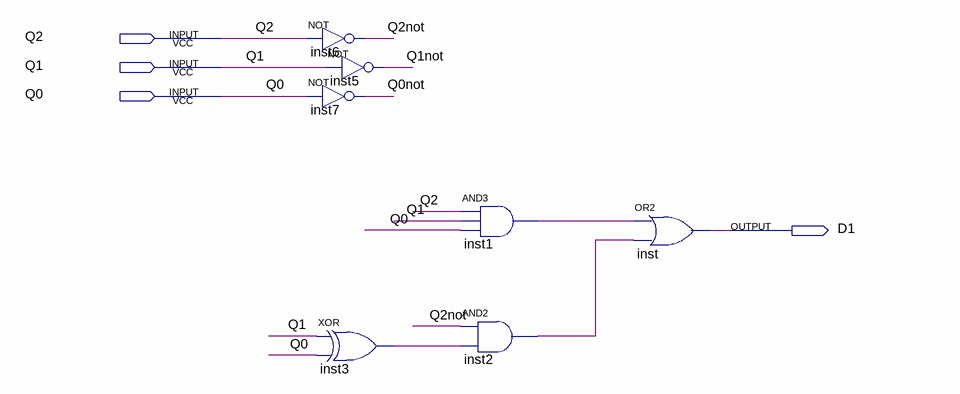
[diagram p0: schematic sheet]
// Quartus schematic D1.bdf as structural Verilog: 7 symbols, 4 pins
module D1 (
  input  Q2,
  input  Q1,
  input  Q0,
  output D1
);

  wire inst1_out, inst2_out, inst3_out, Q0not, Q1not, Q2not;

  not inst6 (Q2not, Q2);
  not inst7 (Q0not, Q0);
  not inst5 (Q1not, Q1);
  xor inst3 (inst3_out, Q1, Q0);
  and inst1 (inst1_out, Q2, Q1, Q0);
  and inst2 (inst2_out, Q2not, inst3_out);
  or inst (D1, inst1_out, inst2_out);
endmodule
